# EAGLE schematic melzi (EAGLE 6.2)
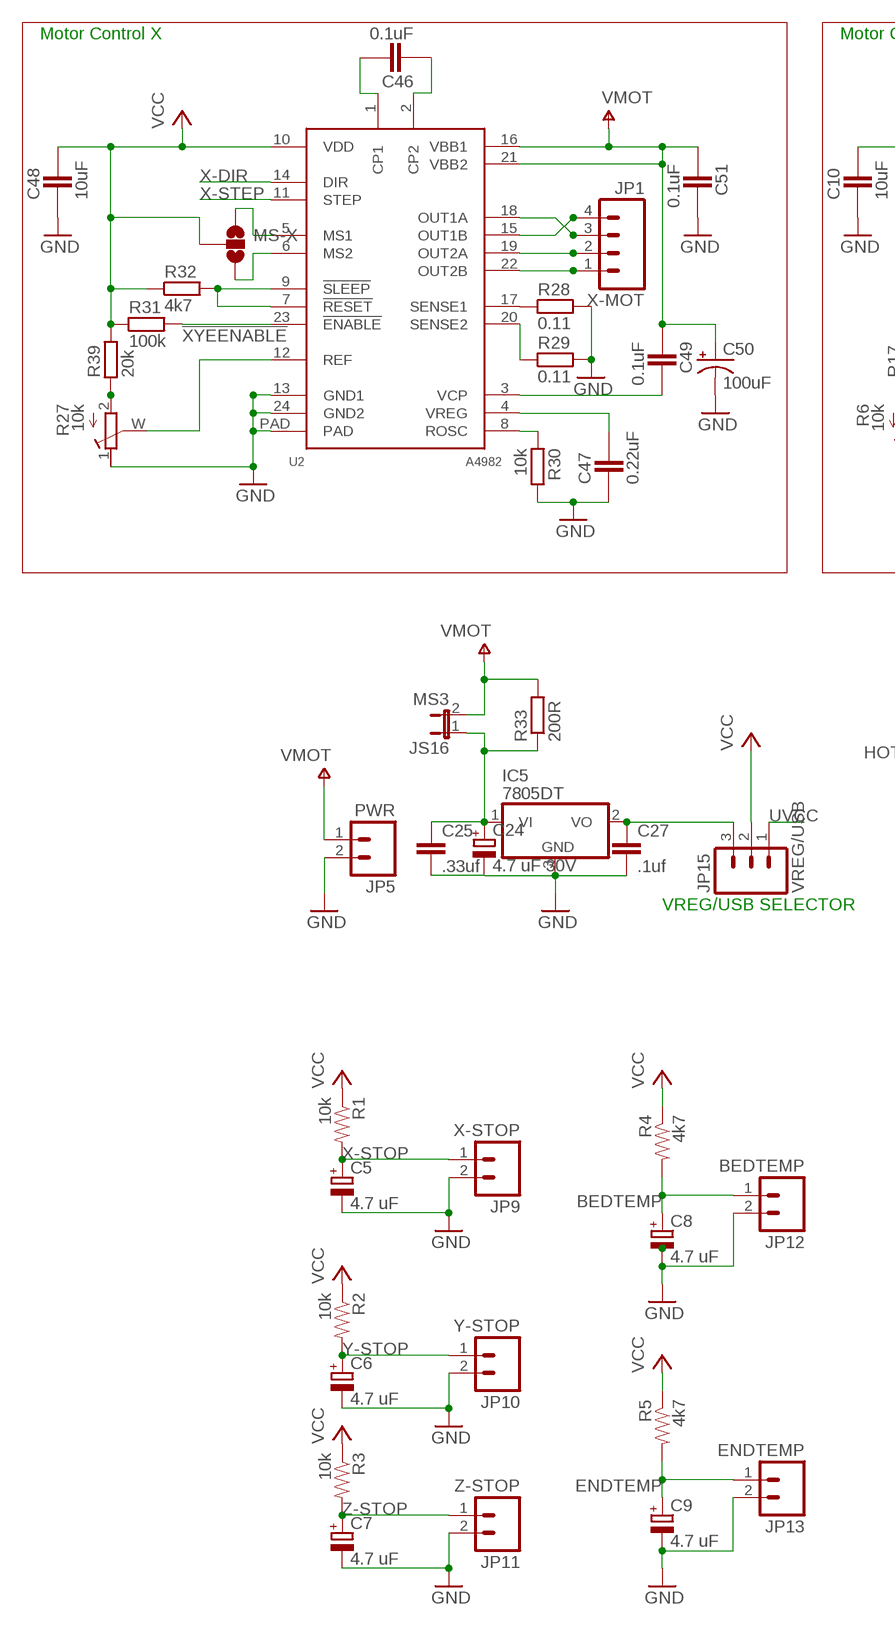
[diagram p0: schematic, sheet 1, part 1 of 2]
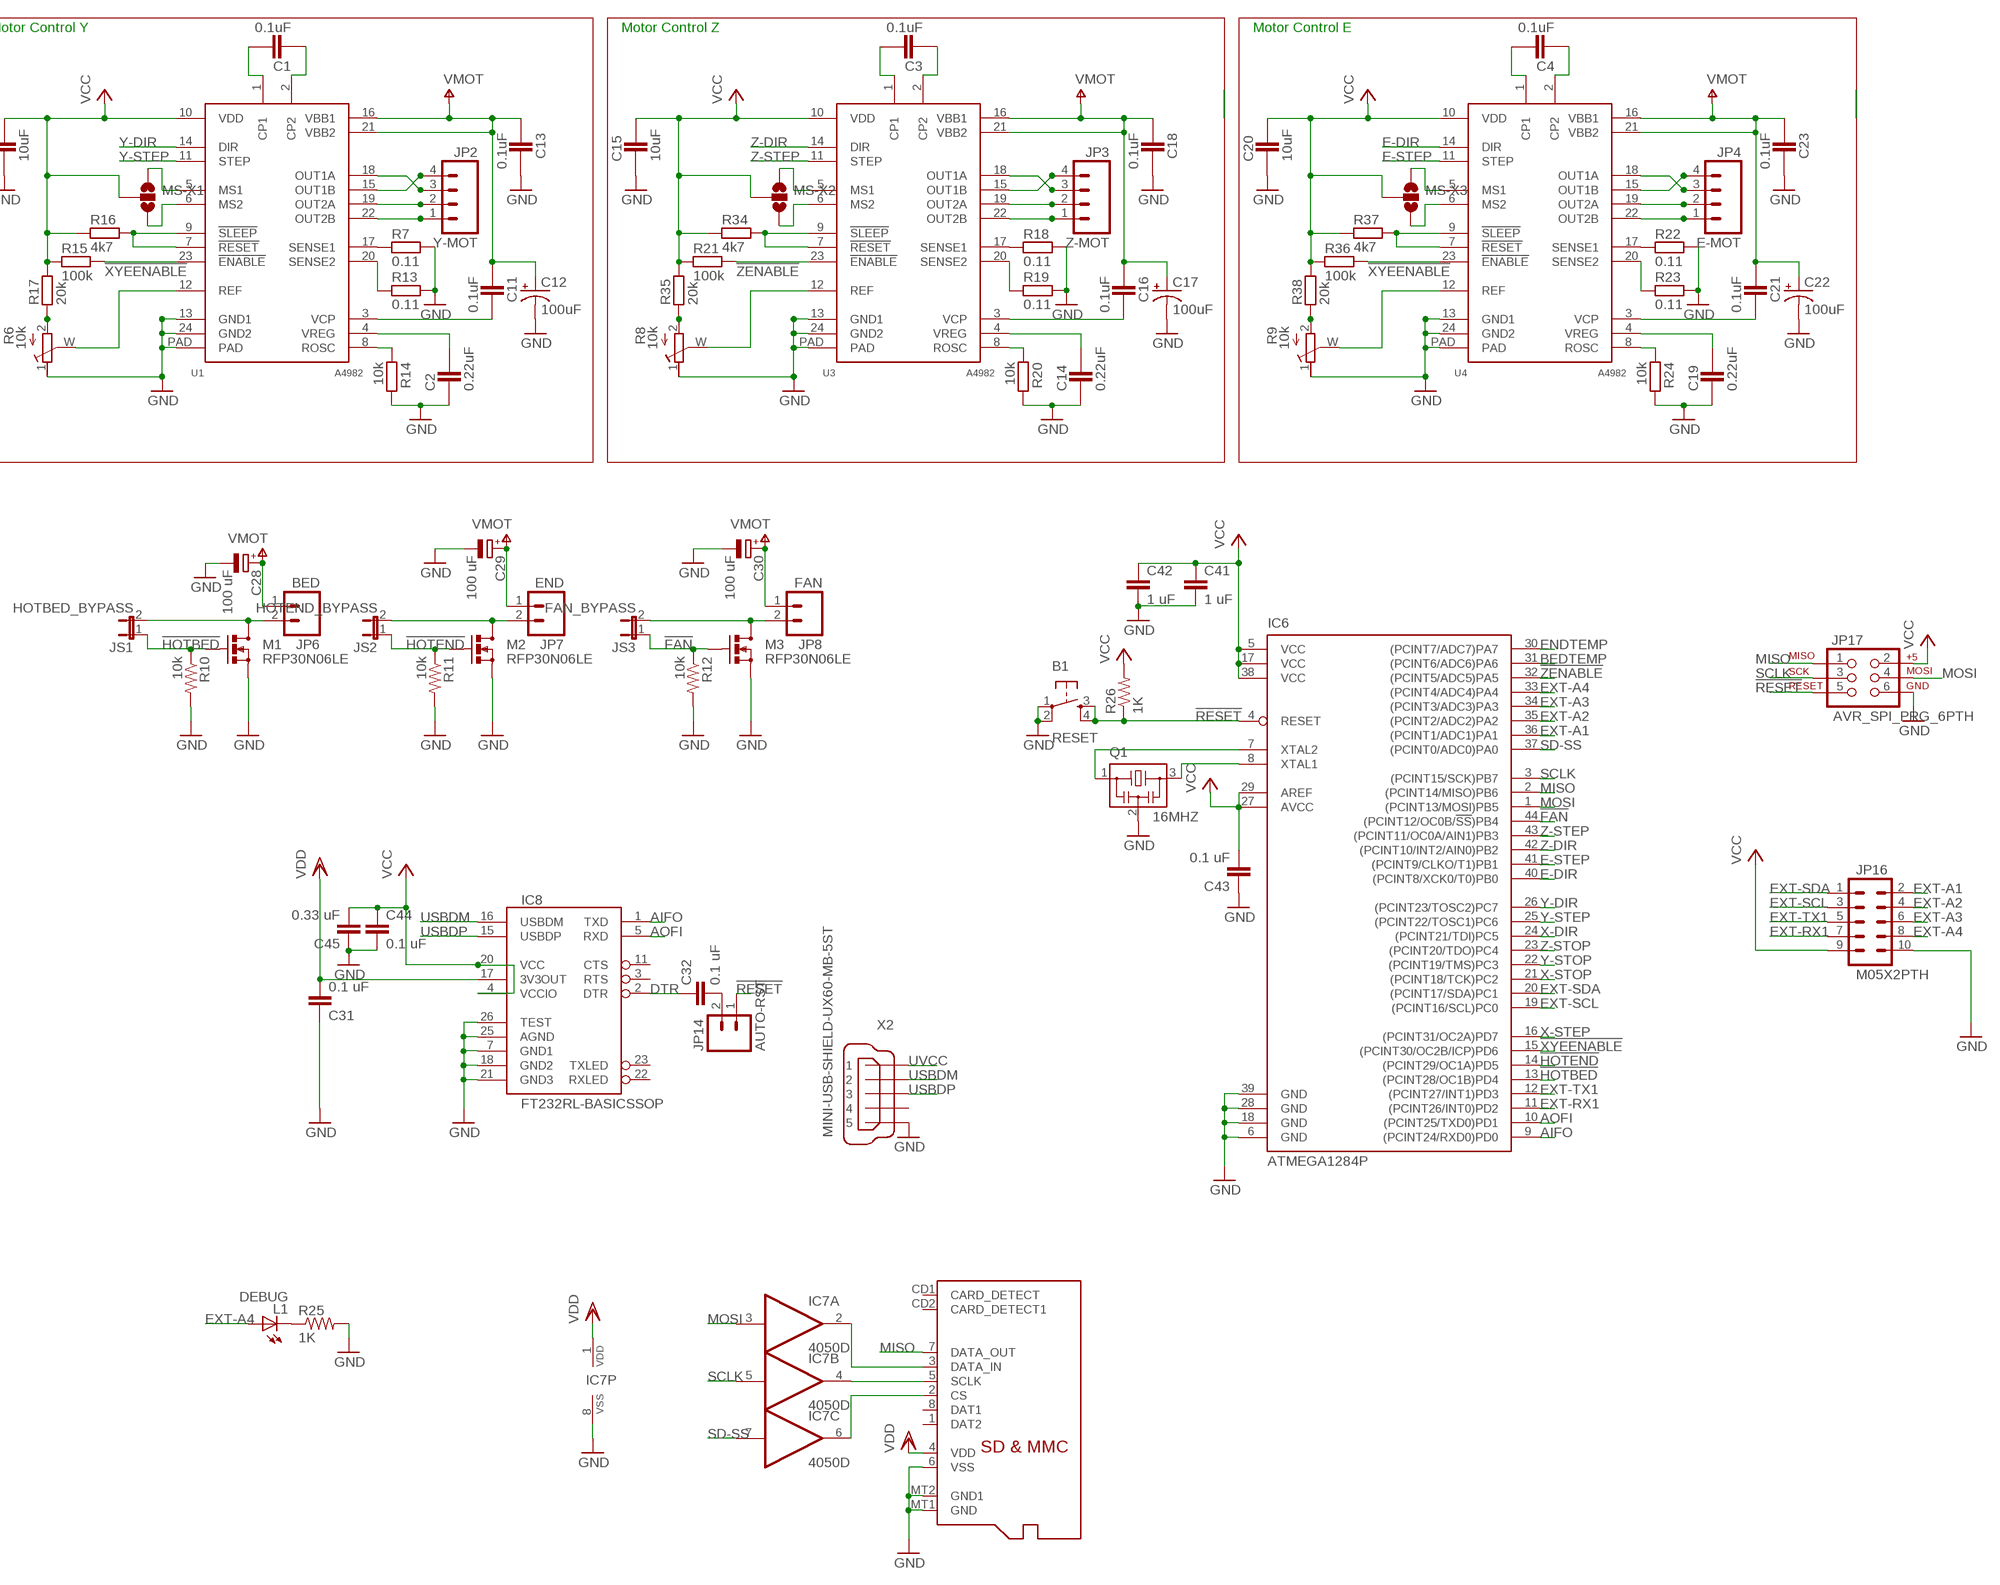
[diagram p1: schematic, sheet 1, part 2 of 2]

## Parts
B1  RESET  TAC_SWITCHSMD  [TACTILE_SWITCH_SMD]
C1  0.1uF  CAPACITOR_0805  [CAPC2012X145AN]
C2  0.22uF  CAPACITOR_0805  [CAPC2012X145AN]
C3  0.1uF  CAPACITOR_0805  [CAPC2012X145AN]
C4  0.1uF  CAPACITOR_0805  [CAPC2012X145AN]
C5  4.7 uF  CPOL-EUSMCC  [SMC_C]
C6  4.7 uF  CPOL-EUSMCC  [SMC_C]
C7  4.7 uF  CPOL-EUSMCC  [SMC_C]
C8  4.7 uF  CPOL-EUSMCC  [SMC_C]
C9  4.7 uF  CPOL-EUSMCC  [SMC_C]
C10  10uF  CAPACITOR_0805  [CAPC2012X145AN]
C11  0.1uF  CAPACITOR_0805  [CAPC2012X145AN]
C12  100uF  CPOL-USD  [PANASONIC_D]
C13  0.1uF  CAPACITOR_0805  [CAPC2012X145AN]
C14  0.22uF  CAPACITOR_0805  [CAPC2012X145AN]
C15  10uF  CAPACITOR_0805  [CAPC2012X145AN]
C16  0.1uF  CAPACITOR_0805  [CAPC2012X145AN]
C17  100uF  CPOL-USD  [PANASONIC_D]
C18  0.1uF  CAPACITOR_0805  [CAPC2012X145AN]
C19  0.22uF  CAPACITOR_0805  [CAPC2012X145AN]
C20  10uF  CAPACITOR_0805  [CAPC2012X145AN]
C21  0.1uF  CAPACITOR_0805  [CAPC2012X145AN]
C22  100uF  CPOL-USD  [PANASONIC_D]
C23  0.1uF  CAPACITOR_0805  [CAPC2012X145AN]
C24  4.7 uF 30V  CPOL-EUSMCC  [SMC_C]
C25  .33uf  CAP0805  [0805]
C27  .1uf  CAP0805  [0805]
C28  100 uF  CPOL-EUUD-6,3X7,7  [UD-6,3X7,7_NICHICON]
C29  100 uF  CPOL-EUUD-6,3X7,7  [UD-6,3X7,7_NICHICON]
C30  100 uF  CPOL-EUUD-6,3X7,7  [UD-6,3X7,7_NICHICON]
C31  0.1 uF  C-EUC1206  [C1206]
C32  0.1 uF  C-EUC1206  [C1206]
C41  1 uF  C-EUC1206  [C1206]
C42  1 uF  C-EUC1206  [C1206]
C43  0.1 uF  C-EUC1206  [C1206]
C44  0.1 uF  C-EUC1206  [C1206]
C45  0.33 uF  C-EUC1206  [C1206]
C46  0.1uF  CAPACITOR_0805  [CAPC2012X145AN]
C47  0.22uF  CAPACITOR_0805  [CAPC2012X145AN]
C48  10uF  CAPACITOR_0805  [CAPC2012X145AN]
C49  0.1uF  CAPACITOR_0805  [CAPC2012X145AN]
C50  100uF  CPOL-USD  [PANASONIC_D]
C51  0.1uF  CAPACITOR_0805  [CAPC2012X145AN]
IC5  7805DT  [TO252]
IC6  ATMEGA1284P  ATMEGA644A  [TQFP44]
IC7  4050D  [SO16]
IC8  FT232RL-BASICSSOP  [SSOP28DB]
JP1  X-MOT  M04SCREW  [SCREWTERMINAL-3.5MM-4]
JP2  Y-MOT  M04SCREW  [SCREWTERMINAL-3.5MM-4]
JP3  Z-MOT  M04SCREW  [SCREWTERMINAL-3.5MM-4]
JP4  E-MOT  M04SCREW  [SCREWTERMINAL-3.5MM-4]
JP5  PWR  M025MM  [SCREWTERMINAL-5MM-2]
JP6  BED  M025MM  [SCREWTERMINAL-5MM-2]
JP7  END  M025MM  [SCREWTERMINAL-5MM-2]
JP8  FAN  M025MM  [SCREWTERMINAL-5MM-2]
JP9  X-STOP  M023.5MM  [SCREWTERMINAL-3.5MM-2]
JP10  Y-STOP  M023.5MM  [SCREWTERMINAL-3.5MM-2]
JP11  Z-STOP  M023.5MM  [SCREWTERMINAL-3.5MM-2]
JP12  BEDTEMP  M023.5MM  [SCREWTERMINAL-3.5MM-2]
JP13  ENDTEMP  M023.5MM  [SCREWTERMINAL-3.5MM-2]
JP14  AUTO-RST  M02PTH  [1X02]
JP15  VREG/USB  M03PTH  [1X03]
JP16  M05X2PTH  [AVR_ICSP]
JP17  AVR_SPI_PRG_6PTH  [2X3]
JS1  HOTBED_BYPASS  JUMPER-2SMD-NO  [SJ_2S-NO]
JS2  HOTEND_BYPASS  JUMPER-2SMD-NO  [SJ_2S-NO]
JS3  FAN_BYPASS  JUMPER-2SMD-NO  [SJ_2S-NO]
JS16  MS3  JUMPER-2SMD-NC  [SJ_2S]
L1  DEBUG  LED1206  [LED-1206]
M1  RFP30N06LE  MOSFET-NCHANNELFDD8580  [DPAK]
M2  RFP30N06LE  MOSFET-NCHANNELFDD8580  [DPAK]
M3  RFP30N06LE  MOSFET-NCHANNELFDD8580  [DPAK]
MS-X  SOLDERJUMPER_2WAYCONNECTED  [SJ_3_CONNECTED]
MS-X1  SOLDERJUMPER_2WAYCONNECTED  [SJ_3_CONNECTED]
MS-X2  SOLDERJUMPER_2WAYCONNECTED  [SJ_3_CONNECTED]
MS-X3  SOLDERJUMPER_2WAYCONNECTED  [SJ_3_CONNECTED]
Q1  16MHZ  CSTCR6M00G53Z  [CSTCR6M]
R1  10k  RESISTOR1206  [1206]
R2  10k  RESISTOR1206  [1206]
R3  10k  RESISTOR1206  [1206]
R4  4k7  RESISTOR1206  [1206]
R5  4k7  RESISTOR1206  [1206]
R6  10k  RTRIM-ST-4EA  [RTRIM-ST4ETB]
R7  0.11  RESISTOR_0805  [RESC2012X70N]
R8  10k  RTRIM-ST-4EA  [RTRIM-ST4ETB]
R9  10k  RTRIM-ST-4EA  [RTRIM-ST4ETB]
R10  10k  RESISTOR1206  [1206]
R11  10k  RESISTOR1206  [1206]
R12  10k  RESISTOR1206  [1206]
R13  0.11  RESISTOR_0805  [RESC2012X70N]
R14  10k  RESISTOR_0805  [RESC2012X70N]
R15  100k  RESISTOR_0805  [RESC2012X70N]
R16  4k7  RESISTOR_0805  [RESC2012X70N]
R17  20k  RESISTOR_0805  [RESC2012X70N]
R18  0.11  RESISTOR_0805  [RESC2012X70N]
R19  0.11  RESISTOR_0805  [RESC2012X70N]
R20  10k  RESISTOR_0805  [RESC2012X70N]
R21  100k  RESISTOR_0805  [RESC2012X70N]
R22  0.11  RESISTOR_0805  [RESC2012X70N]
R23  0.11  RESISTOR_0805  [RESC2012X70N]
R24  10k  RESISTOR_0805  [RESC2012X70N]
R25  1K  RESISTOR1206  [1206]
R26  1K  RESISTOR1206  [1206]
R27  10k  RTRIM-ST-4EA  [RTRIM-ST4ETB]
R28  0.11  RESISTOR_0805  [RESC2012X70N]
R29  0.11  RESISTOR_0805  [RESC2012X70N]
R30  10k  RESISTOR_0805  [RESC2012X70N]
R31  100k  RESISTOR_0805  [RESC2012X70N]
R32  4k7  RESISTOR_0805  [RESC2012X70N]
R33  200R  R-EU_0309/V  [0309V]
R34  4k7  RESISTOR_0805  [RESC2012X70N]
R35  20k  RESISTOR_0805  [RESC2012X70N]
R36  100k  RESISTOR_0805  [RESC2012X70N]
R37  4k7  RESISTOR_0805  [RESC2012X70N]
R38  20k  RESISTOR_0805  [RESC2012X70N]
R39  20k  RESISTOR_0805  [RESC2012X70N]
U1  A4982  [TSSOP-24]
U2  A4982  [TSSOP-24]
U3  A4982  [TSSOP-24]
U4  A4982  [TSSOP-24]
X1  MICROSD  [MICROSD]
X2  MINI-USB-SHIELD-UX60-MB-5ST  [UX60-MB-5ST]

## Nets
!FAN: IC6.44((PCINT12/OC0B/!SS!)PB4) JS3.1 M3.1(G) R12.1
!HOTBED: IC6.13((PCINT28/OC1B)PD4) JS1.1 M1.1(G) R10.1
!HOTEND: IC6.14((PCINT29/OC1A)PD5) JS2.1 M2.1(G) R11.1
!RESET: B1.3 B1.4 IC6.4(RESET) JP14.1 JP17.5 R26.1
!XYEENABLE: IC6.15((PCINT30/OC2B/ICP)PD6) R15.2 R31.2 R36.2 U1.23(!ENABLE) U2.23(!ENABLE) U4.23(!ENABLE)
!ZENABLE: IC6.32((PCINT5/ADC5)PA5) R21.2 U3.23(!ENABLE)
AIFO: IC6.9((PCINT24/RXD0)PD0) IC8.1(TXD)
AOFI: IC6.10((PCINT25/TXD0)PD1) IC8.5(RXD)
BEDTEMP: C8.+ IC6.31((PCINT6/ADC6)PA6) JP12.1 R4.2
DTR: C32.1 IC8.2(DTR)
E-DIR: IC6.40((PCINT8/XCK0/T0)PB0) U4.14(DIR)
E-STEP: IC6.41((PCINT9/CLKO/T1)PB1) U4.11(STEP)
ENDTEMP: C9.+ IC6.30((PCINT7/ADC7)PA7) JP13.1 R5.2
EXT-A1: IC6.36((PCINT1/ADC1)PA1) JP16.2
EXT-A2: IC6.35((PCINT2/ADC2)PA2) JP16.4
EXT-A3: IC6.34((PCINT3/ADC3)PA3) JP16.6
EXT-A4: IC6.33((PCINT4/ADC4)PA4) JP16.8 L1.A
EXT-RX1: IC6.11((PCINT26/INT0)PD2) JP16.7
EXT-SCL: IC6.19((PCINT16/SCL)PC0) JP16.3
EXT-SDA: IC6.20((PCINT17/SDA)PC1) JP16.1
EXT-TX1: IC6.12((PCINT27/INT1)PD3) JP16.5
GND: B1.1 B1.2 C2.1 C5.- C6.- C7.- C8.- C9.- C10.1 C12.- C13.2 C14.1 C15.1 C17.- C18.2 C19.1 C20.1 C22.- C23.2 C24.- C25.2 C27.2 C28.- C29.- C30.- C31.1 C41.2 C42.2 C43.1 C44.2 C45.1 C47.1 C48.1 C50.- C51.2 IC5.3(GND) IC6.6(GND) IC6.18(GND) IC6.28(GND) IC6.39(GND) IC7.8(P:VSS) IC8.7(GND1) IC8.18(GND2) IC8.21(GND3) IC8.25(AGND) IC8.26(TEST) JP5.2 JP9.2 JP10.2 JP11.2 JP12.2 JP13.2 JP16.10 JP17.6 M1.3(S) M2.3(S) M3.3(S) Q1.2 R6.1(A) R7.2 R8.1(A) R9.1(A) R10.2 R11.2 R12.2 R13.2 R14.2 R18.2 R19.2 R20.2 R22.2 R23.2 R24.2 R25.2 R27.1(A) R28.2 R29.2 R30.2 U1.13(GND1) U1.24(GND2) U1.PAD U2.13(GND1) U2.24(GND2) U2.PAD U3.13(GND1) U3.24(GND2) U3.PAD U4.13(GND1) U4.24(GND2) U4.PAD X1.6(VSS) X1.MT1(GND) X1.MT2(GND1) X2.5
HOTBED-GND [power]: JP6.2 JS1.2 M1.4(D)
HOTBED-GND1 [power]: JP7.2 JS2.2 M2.4(D)
HOTBED-GND2 [power]: JP8.2 JS3.2 M3.4(D)
MISO: IC6.2((PCINT14/MISO)PB6) JP17.1 X1.7(DATA_OUT)
MOSI: IC6.1((PCINT13/MOSI)PB5) IC7.3(A:I) JP17.4
N$1: C46.2 U2.1(CP1)
N$2: L1.C R25.1
N$3: C1.2 U1.1(CP1)
N$4: C46.1 U2.2(CP2)
N$5: R28.1 U2.17(SENSE1)
N$6: R29.1 U2.20(SENSE2)
N$7: R27.W(S) U2.12(REF)
N$8: R30.1 U2.8(ROSC)
N$9: C47.2 U2.4(VREG)
N$10: R32.2 U2.7(!RESET) U2.9(!SLEEP)
N$11: C1.1 U1.2(CP2)
N$12: IC7.2(A:O) X1.3(DATA_IN)
N$13: IC7.4(B:O) X1.5(SCLK)
N$14: IC7.6(C:O) X1.2(CS)
N$15: C27.1 IC5.2(VO) JP15.3
N$16: R7.1 U1.17(SENSE1)
N$17: R13.1 U1.20(SENSE2)
N$18: R6.W(S) U1.12(REF)
N$19: R14.1 U1.8(ROSC)
N$20: C3.2 U3.1(CP1)
N$21: C3.1 U3.2(CP2)
N$22: R18.1 U3.17(SENSE1)
N$23: C49.2 U2.3(VCP)
N$25: C4.2 U4.1(CP1)
N$26: C32.2 JP14.2
N$27: C4.1 U4.2(CP2)
N$28: IC6.7(XTAL2) Q1.1
N$29: IC6.8(XTAL1) Q1.3
N$30: MS-X.1 U2.5(MS1)
N$31: MS-X.3 U2.6(MS2)
N$32: JP1.3 U2.18(OUT1A)
N$33: JP1.4 U2.15(OUT1B)
N$34: JP1.2 U2.19(OUT2A)
N$35: JP1.1 U2.22(OUT2B)
N$36: C24.+ C25.1 IC5.1(VI) JS16.1 R33.1
N$37: C2.2 U1.4(VREG)
N$38: R16.2 U1.7(!RESET) U1.9(!SLEEP)
N$39: C11.2 U1.3(VCP)
N$40: MS-X1.1 U1.5(MS1)
N$41: MS-X1.3 U1.6(MS2)
N$42: JP2.3 U1.18(OUT1A)
N$43: JP2.4 U1.15(OUT1B)
N$44: JP2.2 U1.19(OUT2A)
N$45: JP2.1 U1.22(OUT2B)
N$46: R6.2(E) R17.1
N$47: R19.1 U3.20(SENSE2)
N$48: R8.W(S) U3.12(REF)
N$49: R20.1 U3.8(ROSC)
N$50: C14.2 U3.4(VREG)
N$51: R34.2 U3.7(!RESET) U3.9(!SLEEP)
N$52: C16.2 U3.3(VCP)
N$53: MS-X2.1 U3.5(MS1)
N$54: MS-X2.3 U3.6(MS2)
N$55: JP3.3 U3.18(OUT1A)
N$56: JP3.4 U3.15(OUT1B)
N$57: JP3.2 U3.19(OUT2A)
N$58: JP3.1 U3.22(OUT2B)
N$59: R8.2(E) R35.1
N$60: R22.1 U4.17(SENSE1)
N$61: R23.1 U4.20(SENSE2)
N$62: R9.W(S) U4.12(REF)
N$63: R24.1 U4.8(ROSC)
N$64: C19.2 U4.4(VREG)
N$65: R37.2 U4.7(!RESET) U4.9(!SLEEP)
N$66: C21.2 U4.3(VCP)
N$67: MS-X3.1 U4.5(MS1)
N$68: MS-X3.3 U4.6(MS2)
N$69: R27.2(E) R39.1
N$70: JP4.3 U4.18(OUT1A)
N$71: JP4.4 U4.15(OUT1B)
N$72: JP4.2 U4.19(OUT2A)
N$73: JP4.1 U4.22(OUT2B)
N$74: R9.2(E) R38.1
SCLK: IC6.3((PCINT15/SCK)PB7) IC7.5(B:I) JP17.3
SD-SS: IC6.37((PCINT0/ADC0)PA0) IC7.7(C:I)
USBDM: IC8.16(USBDM) X2.2
USBDP: IC8.15(USBDP) X2.3
UVCC [input]: JP15.1 X2.1
VCC [power]: C10.2 C15.2 C20.2 C41.1 C42.1 C43.2 C44.1 C45.2 C48.2 IC6.5(VCC) IC6.17(VCC) IC6.27(AVCC) IC6.29(AREF) IC6.38(VCC) IC8.4(VCCIO) IC8.20(VCC) JP15.2 JP16.9 JP17.2 MS-X1.2 MS-X2.2 MS-X3.2 MS-X.2 R1.1 R2.1 R3.1 R4.1 R5.1 R15.1 R16.1 R17.2 R21.1 R26.2 R31.1 R32.1 R34.1 R35.2 R36.1 R37.1 R38.2 R39.2 U1.10(VDD) U2.10(VDD) U3.10(VDD) U4.10(VDD)
VDD: C31.2 IC7.1(P:VDD) IC8.17(3V3OUT) X1.4(VDD)
VMOT: C11.1 C12.+ C13.1 C16.1 C17.+ C18.1 C21.1 C22.+ C23.1 C28.+ C29.+ C30.+ C49.1 C50.+ C51.1 JP5.1 JP6.1 JP7.1 JP8.1 JS16.2 R33.2 U1.16(VBB1) U1.21(VBB2) U2.16(VBB1) U2.21(VBB2) U3.16(VBB1) U3.21(VBB2) U4.16(VBB1) U4.21(VBB2)
X-DIR: IC6.24((PCINT21/TDI)PC5) U2.14(DIR)
X-STEP: IC6.16((PCINT31/OC2A)PD7) U2.11(STEP)
X-STOP: C5.+ IC6.21((PCINT18/TCK)PC2) JP9.1 R1.2
Y-DIR: IC6.26((PCINT23/TOSC2)PC7) U1.14(DIR)
Y-STEP: IC6.25((PCINT22/TOSC1)PC6) U1.11(STEP)
Y-STOP: C6.+ IC6.22((PCINT19/TMS)PC3) JP10.1 R2.2
Z-DIR: IC6.42((PCINT10/INT2/AIN0)PB2) U3.14(DIR)
Z-STEP: IC6.43((PCINT11/OC0A/AIN1)PB3) U3.11(STEP)
Z-STOP: C7.+ IC6.23((PCINT20/TDO)PC4) JP11.1 R3.2
Unconnected: IC7.9(D:I) IC7.10(D:O) IC7.11(E:I) IC7.12(E:O) IC7.14(F:I) IC7.15(F:O) IC8.3(RTS) IC8.11(CTS) IC8.22(RXLED) IC8.23(TXLED) X1.1(DAT2) X1.8(DAT1) X1.CD1(CARD_DETECT) X1.CD2(CARD_DETECT1) X2.4 X2.M1(S1) X2.M2(S2) X2.M3(S3) X2.M4(S4)

## Notes on the sheet
- Motor Control X | Motor Control Y | Motor Control Z | Motor Control E
- VREG/USB SELECTOR

## Library data of the parts
B1 = SparkFun:TAC_SWITCH: Momentary Switch Button commonly used for reset or general input. Spark Fun Electronics SKU : COM-00097
C1-C4 C10 C11 C13-C16 C18-C21 C23 C46-C49 C51 = ipc-7351-capacitor:CAPACITOR_
C5-C9 C24 C28-C30 = rcl:CPOL-EU: POLARIZED CAPACITOR, European symbol
C12 C17 C22 C50 = rcl:CPOL-US: POLARIZED CAPACITOR, American symbol
C25 C27 = SparkFun:CAP: Capacitor Standard 0603 ceramic capacitor, and 0.1" leaded capacitor.
C31 C32 C41-C45 = rcl:C-EU: CAPACITOR, European symbol
IC5 = linear:78*: Positive VOLTAGE REGULATOR Source: http://cache.national.com/ds/LM/LM78L05.pdf http://www.fairchildsemi.com/ds/LM/LM7805.pdf
IC6 = atmel:ATMEGA644: 8-bit Microcontroller with 64K Bytes In-System Programmable Flash Source: http://www.atmel.com/dyn/resources/prod_documents/doc2593.pdf; MPN: ATMEGA644PV-10AU; OC_FARNELL: 1455123; OC_NEWARK: 58M3748
IC7 = 40xx:4050: Hex non-inverting BUFFER
IC8 = SparkFun:FT232RL-BASIC: USB UART This is the simplified version of the FT232RL unit. Only what you need, nothing you don't. Spark Fun Electronics SKU : COM-00650
JP1-JP4 = SparkFun:M04: Header 4 Standard 4-pin 0.1" header. Use with straight break away headers (SKU : PRT-00116), right angle break away headers (PRT-00553), swiss pins (PRT-00743), machine pins (PRT-00117), and female headers (PRT-00115). Molex polarized connector foot print use with SKU : PRT-08231 with associated crimp pins and housings. 1MM SMD Version SKU: PRT-10208
JP5-JP14 = SparkFun:M02: Header 2 Standard 2-pin 0.1" header. Use with straight break away headers (SKU : PRT-00116), right angle break away headers (PRT-00553), swiss pins (PRT-00743), machine pins (PRT-00117), and female headers (PRT-00115). Molex polarized connector foot print use with SKU : PRT-08233 with associated crimp pins and housings.
JP15 = SparkFun:M03: Header 3 Standard 3-pin 0.1" header. Use with straight break away headers (SKU : PRT-00116), right angle break away headers (PRT-00553), swiss pins (PRT-00743), machine pins (PRT-00117), and female headers (PRT-00115). Molex polarized connector foot print use with SKU : PRT-08232 with associated crimp pins and housings.
JP16 = SparkFun:M05X2: Header 5x2 Standard 10-pin dual row 0.1" header. Commonly used with AVR-ISP. Use with Spark Fun Electronics SKU: PRT-00778
JP17 = SparkFun:AVR_SPI_PRG_6: AVR ISP 6 Pin This is the reduced ISP connector for AVR programming. Common on Arduino. This footprint will take up less PCB space and can be used with a 10-pin to 6-pin adapter such as SKU: BOB-08508
JS1-JS3 JS16 = SparkFun:JUMPER-2: Jumper Basic 0.1" spaced jumper. Use with breakaway headers.
L1 = SparkFun:LED: LEDs Standard schematic elements and footprints for 5mm, 3mm, 1206, and 0603 sized LEDs. 5mm - Spark Fun Electronics SKU : COM-00529 (and others)
M1-M3 = SparkFun:MOSFET-NCHANNEL
MS-X MS-X1-MS-X3 = printrbot:SOLDERJUMPER_2WAY: Solder Jumper 2 way solder jumper
Q1 = murata-filter:CSTCR: Resonator Source: murata.co.jp; MPN: CSTCR6M00G53-R0; OC_FARNELL: 1170434; OC_NEWARK: 25M8759
R1-R5 R10-R12 R25 R26 = SparkFun:RESISTOR: Resistor Basic schematic elements and footprints for 0603, 1206, and PTH 1/10th watt (small) resistors.
R6 R8 R9 R27 = printrbot:RTRIM-ST-4EA
R7 R13-R24 R28-R32 R34-R39 = ipc-7351-resistor:RESISTOR_
R33 = rcl:R-EU_: RESISTOR, European symbol
U1-U4 = printrbot:A4982
X1 = adafruit:MICROSD: Micro-SD / Transflash card holder with SPI pinout For the 3M # 2908-05WB-MG and/or 4UCON #19656 push-push type
X2 = con-hirose:MINI-USB-SHIELD-: MINI USB Connector Source: http://www.hirose.co.jp/cataloge_hp/e24000019.pdf; OC_FARNELL: unknown; OC_NEWARK: unknown